# EAGLE design controller SHIM (EAGLE 9.6.2)
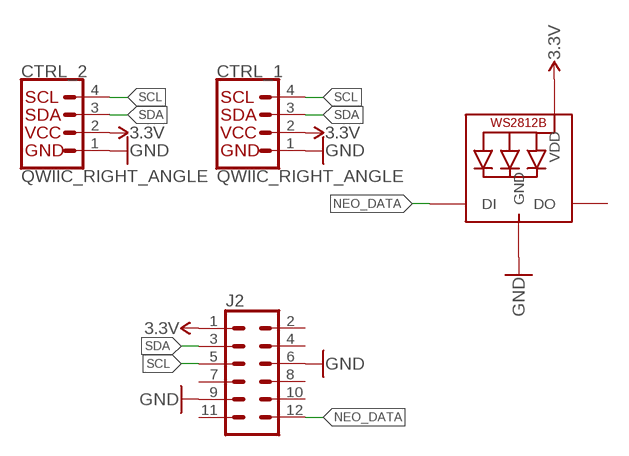
[diagram p0: schematic, sheet 1]

## Parts
CTRL_1  QWIIC_RIGHT_ANGLE  QWIIC_CONNECTORJS-1MM  [JST04_1MM_RA]
CTRL_2  QWIIC_RIGHT_ANGLE  QWIIC_CONNECTORJS-1MM  [JST04_1MM_RA]
J2  CONN_06X2SMD_FEMALE  [2X6_SMD]
STATUS_LED  WS2812B3535  [LED3535]

## Nets
3.3V: CTRL_1.2 CTRL_2.2 J2.1 STATUS_LED.2(VDD)
GND: CTRL_1.1 CTRL_2.1 J2.6 J2.9 STATUS_LED.4(GND)
NEO_DATA: J2.12 STATUS_LED.1(DI)
SCL: CTRL_1.4 CTRL_2.4 J2.5
SDA: CTRL_1.3 CTRL_2.3 J2.3
Unconnected: J2.2 J2.4 J2.7 J2.8 J2.10 J2.11 STATUS_LED.3(DO)

## Library data of the parts
CTRL_1 CTRL_2 = SparkFun-Connectors:QWIIC_CONNECTOR: SparkFun I2C Standard Qwiic Connector An SMD 1mm pitch JST connector makes it easy and quick (get it? Qwiic?) to connect I2C devices to each other. The Qwiic system <http://www.sparkfun.com/qwiic> enables fast and solderless connection between popular platforms and various sensors and actuators. We carry 200mm <https://www.sparkfun.com/products/14204>, 100mm <https://www.sparkfun.com/products/14205>, 50mm <https://www.sparkfun.com/products/14206>, and breadboard friendly <https://www.sparkfun.com/products/14207> Qwiic cables. We also offer 10 pcs strips <https://www.sparkfun.com/products/14323> the SMD connectors.; PROD_ID: CONN-13694
J2 = SparkFun-Connectors:CONN_06X2: Multi connection point. Often used as Generic Header-pin footprint for 0.1 inch spaced/style header connections On any of the 0.1 inch spaced packages, you can populate with these: Break Away Headers - Straight <https://www.sparkfun.com/products/116> (PRT-00116) Break Away Male Headers - Right Angle <https://www.sparkfun.com/products/553> (PRT-00553) Female Headers <https://www.sparkfun.com/products/115> (PRT-00115) Break Away Headers - Machine Pin <https://www.sparkfun.com/products/117> (PRT-00117) Break Away Female Headers - Swiss Machine Pin <https://www.sparkfun.com/products/743> (PRT-00743)
STATUS_LED = adafruit:WS2812B

## Board
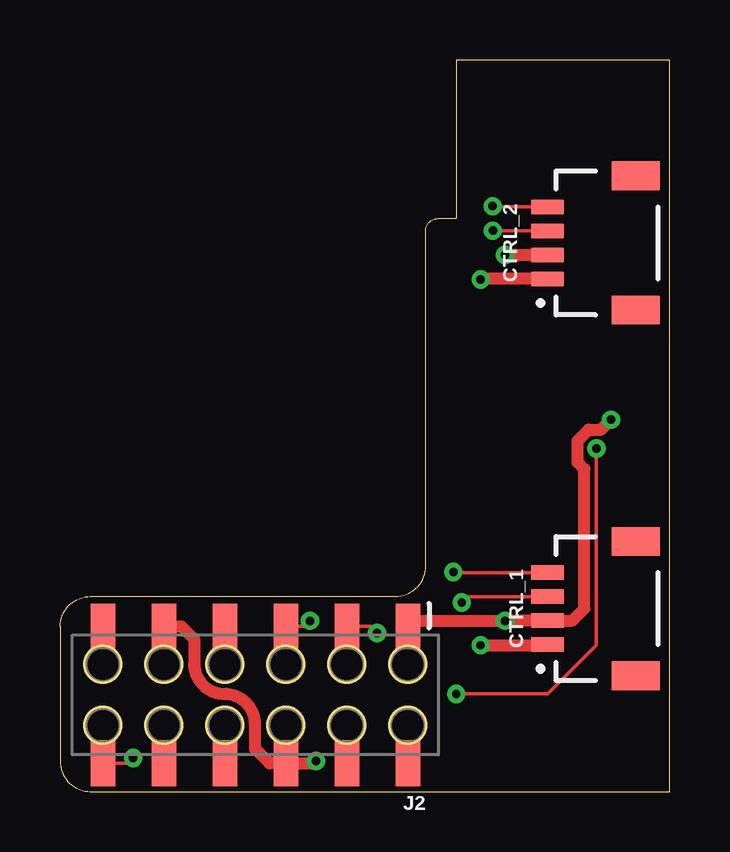
[diagram p1: board, top side]
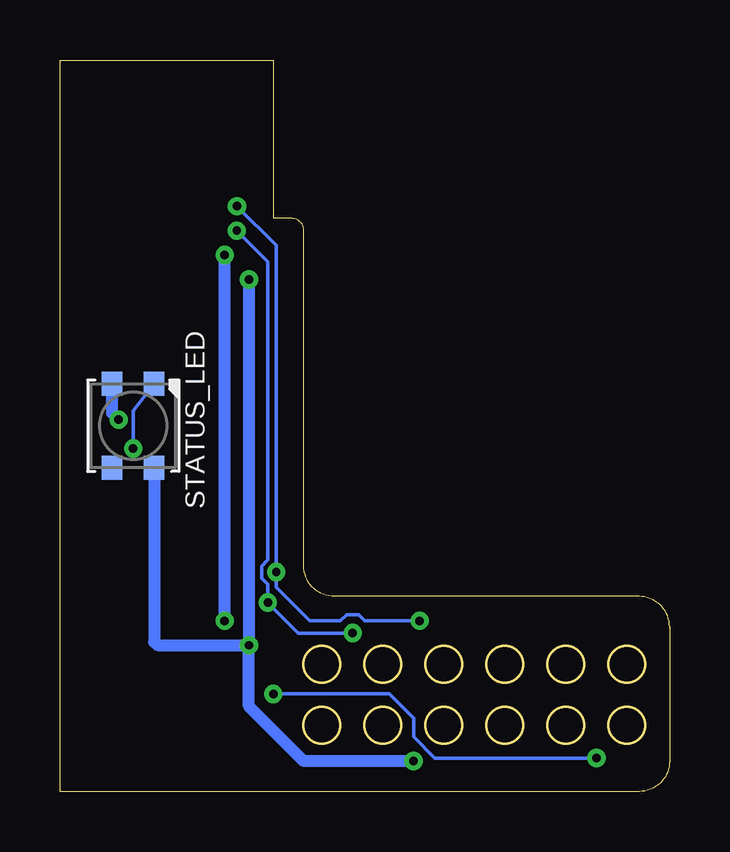
[diagram p2: board, bottom side, seen from below]

Size 25.4 x 30.48 mm. Coordinates in mm from the lower left corner, seen from the top.
Outline: 1.27,0 25.4,0 25.4,30.48 16.51,30.48 16.51,23.88 15.75,23.88 arc90 15.24,23.37 15.24,9.4 arc-90 13.97,8.13 1.27,8.13 arc90 0,6.86 0,1.27 arc90 1.27,0
Copper layers (1*16): Top 0.035mm / dielectric 1.5mm / Bottom 0.035mm
Design rules "default": minimum track width 6mil, minimum drill 0.35mm, track to track 6mil, track to pad 6mil, pad to pad 6mil, via to via 6mil, smd to smd 6mil, copper to edge 40mil, drill to drill 6mil, minimum pad ring 10mil, minimum via ring 8mil, stop-mask expansion 4mil, vias tented up to drill 0mil, thermal gap 10mil
Milling: area 1,4.5 to 2.6,6.1; area 3.6,4.5 to 5.1,6.1; area 6.1,4.5 to 7.6,6.1; area 8.6,4.5 to 10.2,6.1; area 11.2,4.5 to 12.7,6.1; area 13.7,4.5 to 15.3,6.1; area 13.7,2 to 15.3,3.5; area 11.2,2 to 12.7,3.5; area 8.6,2 to 10.2,3.5; area 6.1,2 to 7.6,3.5; area 3.6,2 to 5.1,3.5; area 1,2 to 2.6,3.5

### Footprints (pad centres in the part's own frame; a part is rotated, then mirrored left to right if it is on the bottom)
JST04_1MM_RA = smd 0.6 x 1.35: 1 -1.5,0; 2 -0.5,0; 3 0.5,0; 4 1.5,0 | smd 1.2 x 2: NC1 2.8,-3.675; NC2 -2.8,-3.675
2X6_SMD = smd 1.02 x 1.9: 1 -6.35,-2.85; 2 -6.35,2.85; 3 -3.81,-2.85; 4 -3.81,2.85; 5 -1.27,-2.85; 6 -1.27,2.85; 7 1.27,-2.85; 8 1.27,2.85; 9 3.81,-2.85; 10 3.81,2.85; 11 6.35,-2.85; 12 6.35,2.85
LED3535 = smd 1 x 0.85: 1 -1.75,0.875; 2 -1.75,-0.875; 3 1.75,-0.875; 4 1.75,0.875

### Placement (x,y rotation side)
CTRL_1  20.32,7.62 90 top
CTRL_2  20.32,22.86 90 top
J2  8.14,4.03 180 top
STATUS_LED  22.35,15.24 270 bottom

### Tracks (layer width: path | path; a pad name or v marks a point on that pad's centre or on a via)
3.3V  (via drill 0.35)
  Top 0.508: v18.54,22.35 v18.55,22.36 CTRL_2.2 | J2.1 14.73,7.11 v18.54,7.11 CTRL_1.2 21.34,7.12 21.84,7.62 21.84,13.44 21.57,13.71 21.57,14.62 22.03,15.07 22.54,15.07 v22.96,15.49
  Bottom 0.508: v18.54,7.11 v18.54,22.35 | v22.96,15.49 23.23,15.76 STATUS_LED.2
GND  (via drill 0.35)
  Top 0.508: CTRL_2.1 17.55,21.36 v17.53,21.34 | v17.53,6.1 20.3,6.1 CTRL_1.1 | J2.9 5.06,6.88 5.59,6.35 5.59,5.33 arc90 6.86,4.06 arc-90 8.13,2.79 8.13,1.78 8.73,1.18 J2.6 10.57,1.18 v10.67,1.27
  Bottom 0.508: v17.53,21.34 v17.53,6.1 | v10.67,1.27 15.24,1.27 17.53,3.56 v17.53,6.1 | STATUS_LED.4 21.48,6.24 21.34,6.1 v17.53,6.1
NEO_DATA  (via drill 0.35)
  Top 0.152: J2.12 2.83,1.18 v3.05,1.39 | v16.51,4.06 20.32,4.06 22.35,6.1 v22.35,14.29
  Bottom 0.152: v3.05,1.39 9.78,1.39 10.67,2.29 10.67,3.05 11.68,4.06 v16.51,4.06 | v22.35,14.29 22.35,15.86 STATUS_LED.1
SCL  (via drill 0.35)
  Top 0.152: CTRL_2.4 18.06,24.36 v18.03,24.39 | v16.39,9.14 16.41,9.12 CTRL_1.4 | J2.5 10.18,6.88 v10.41,7.11
  Bottom 0.152: v18.03,24.39 16.39,22.75 v16.39,9.14 16.39,8.52 14.99,7.11 13.72,7.11 13.46,7.37 12.95,7.37 12.7,7.11 v10.41,7.11
SDA  (via drill 0.35)
  Top 0.152: CTRL_2.3 18.04,23.36 v18.03,23.37 | CTRL_1.3 16.99,8.12 v16.74,7.87 | J2.3 12.94,6.88 v13.21,6.6
  Bottom 0.152: v18.03,23.37 16.74,22.07 16.74,9.65 17,9.39 17,8.89 16.74,8.64 v16.74,7.87 15.47,6.6 v13.21,6.6